# Altium schematic sheet 9.Fan.SchDoc
size A4; SheetNumber: 10; SheetTotal: 13
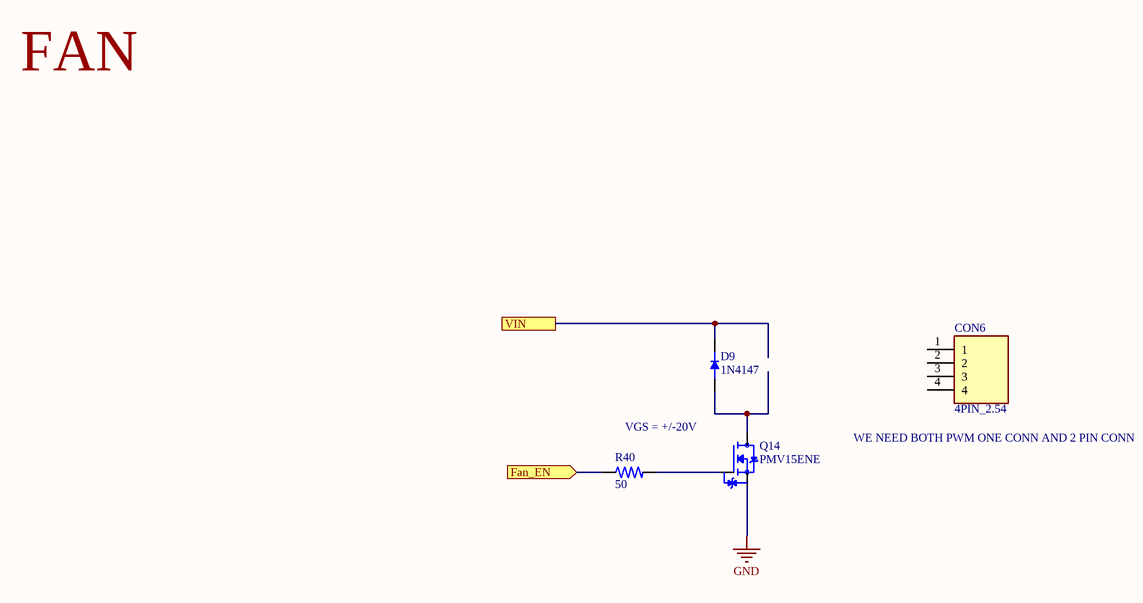
[diagram p0: 9.Fan.SchDoc]

## Parts
CON6  4PIN_2.54  [4Pin_2.5]
D9  1N4147  [SOD123]
Q14  PMV15ENE  [SOT23FR]
R40  50  [R_0603]

## Ports
Fan_EN (in), VIN

## Nets
GND: Q14.3(S)
Fan_EN: R40.1 ; port Fan_EN
VIN: D9.C(K) ; port VIN
NetD9_A: D9.A Q14.1(D)
NetQ14_2: Q14.2(G) R40.2

Not connected (* = marked no-connect by the designer): CON6 1 2 3 4

## Notes on the sheet
- FAN
- VGS = +/-20V
- (near CON6) WE NEED BOTH PWM ONE CONN AND 2 PIN CONN

## Library data of the parts
CON6 = 4PIN_2.54: PN: 87224-4
D9 = 1N4147: MFR: Panjit; PN: 1N4148W_R2_00001; D: Diodes - General Purpose, Power, Switching SURFACE MOUNT SWITCHING DIODES; P: SOD123; URL: https://www.mouser.in/ProductDetail/Panjit/1N4148W_R2_00001?qs=sPbYRqrBIVlsNrvmMQOkFA%3D%3D
Q14 = PMV15ENE: MFR: Nexperia; P: SOT-23-3; PN: PMV15ENER; D: MOSFET PMV15ENE/SOT23/TO-236AB; URL: https://www.mouser.in/ProductDetail/Nexperia/PMV15ENER?qs=Li%252BoUPsLEntpTHKsialBmQ%3D%3D
R40 = R_0603: D: *; MFR: *; P: *; PN: *; URL: *